# Altium schematic sheet USB.SchDoc
size A4
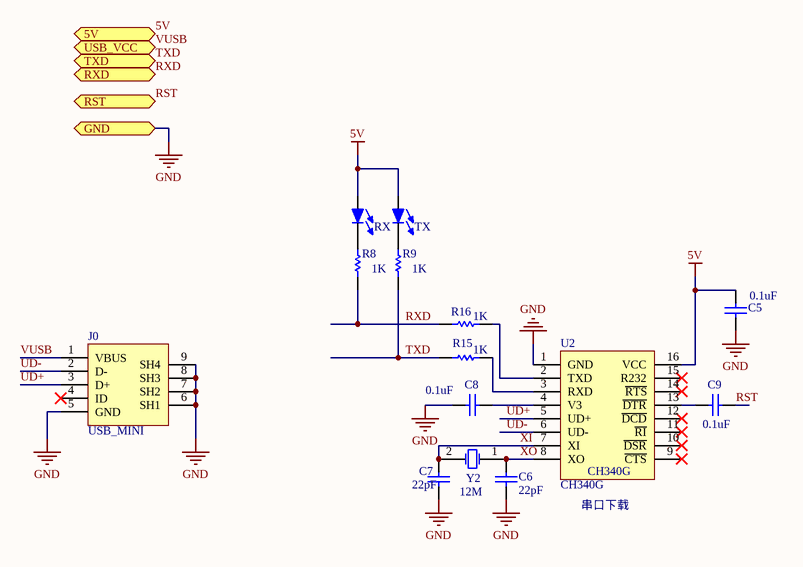
[diagram p0: USB.SchDoc]

## Parts
C5  value 0.1uF  [6-0805_N]  (hidden comment: Cap)
C6  value 22pF  [6-0805_N]  (hidden comment: Cap)
C7  value 22pF  [6-0805_N]  (hidden comment: Cap)
C8  value 0.1uF  [6-0805_N]  (hidden comment: Cap)
C9  value 0.1uF  [6-0805_N]  (hidden comment: Cap)
J0  USB_MINI  [MICRO_USB]
R8  value 1K  [6-0805_N]  (hidden comment: Res1)
R9  value 1K  [6-0805_N]  (hidden comment: Res1)
R15  value 1K  [6-0805_N]  (hidden comment: Res1)
R16  value 1K  [6-0805_N]  (hidden comment: Res1)
RX  LED  [LED_0805]  (value not drawn)
TX  LED  [LED_0805]  (value not drawn)
U2  CH340G  [SOP16]
Y2  12M  [Crystal_Oscillator]

## Ports
5V (in), GND, RST, RXD (out), TXD (in), USB_VCC (out)

## Nets
5V: C5.2 RX.1 TX.1 U2.16(VCC) ; port 5V
GND: C5.1 C6.1 C7.1 C8.1 J0.5(GND) J0.6(SH1) J0.7(SH2) J0.8(SH3) J0.9(SH4) U2.1(GND) ; port GND
RST: C9.2 ; port RST
RXD: R8.1 R16.1 ; port RXD
TXD: R9.1 R15.1 ; port TXD
UD+: J0.3(D+) U2.5(UD+)
UD-: J0.2(D-) U2.6(UD-)
VUSB: J0.1(VBUS) ; port USB_VCC
XI: C7.2 U2.7(XI) Y2.2(OSC2)
XO: C6.2 U2.8(XO) Y2.1(OSC1)
NetC8_2: C8.2 U2.4(V3)
NetC9_1: C9.1 U2.13(~{DTR})
NetR8_2: R8.2 RX.2
NetR9_2: R9.2 TX.2
NetR15_2: R15.2 U2.3(RXD)
NetR16_2: R16.2 U2.2(TXD)

Not connected (* = marked no-connect by the designer): J0 4(ID)*; U2 9(~{CTS})* 10(~{DSR})* 11(~{RI})* 12(~{DCD})* 14(~{RTS})* 15(R232)*

## Notes on the sheet
- (near U2) 串口下载

## Library data of the parts
C5-C9 = Cap: Capacitor; Published: 8-Jun-2000; LatestRevisionDate: 17-Jul-2002; LatestRevisionNote: Re-released for DXP Platform.; PackageReference: RAD-0.3; Publisher: Altium Limited; PackageDescription: Radial Cap, Thru-Hole; 2 Leads; 0.3 in Pin Spacing
R8 R9 R15 R16 = Res1: Resistor; Published: 8-Jun-2000; LatestRevisionDate: 17-Jul-2002; LatestRevisionNote: Re-released for DXP Platform.; PackageReference: AXIAL-0.3; Publisher: Altium Limited; PackageDescription: Axial Device, Thru-Hole; 2 Leads; 0.3 in Pin Spacing
Y2 = XTAL: Crystal Oscillator; Published: 8-Jun-2000; LatestRevisionDate: 17-Jul-2002; LatestRevisionNote: Re-released for DXP Platform.; PackageReference: R38; Publisher: Altium Limited; PackageDescription: Crystal, Thru-Hole; 2 Leads; Body 3.1 x 8.2 mm (Dia.xH)